# Altium schematic sheet QCLogic Rev A Sht7 MCU CTRL.SchDoc
size A4
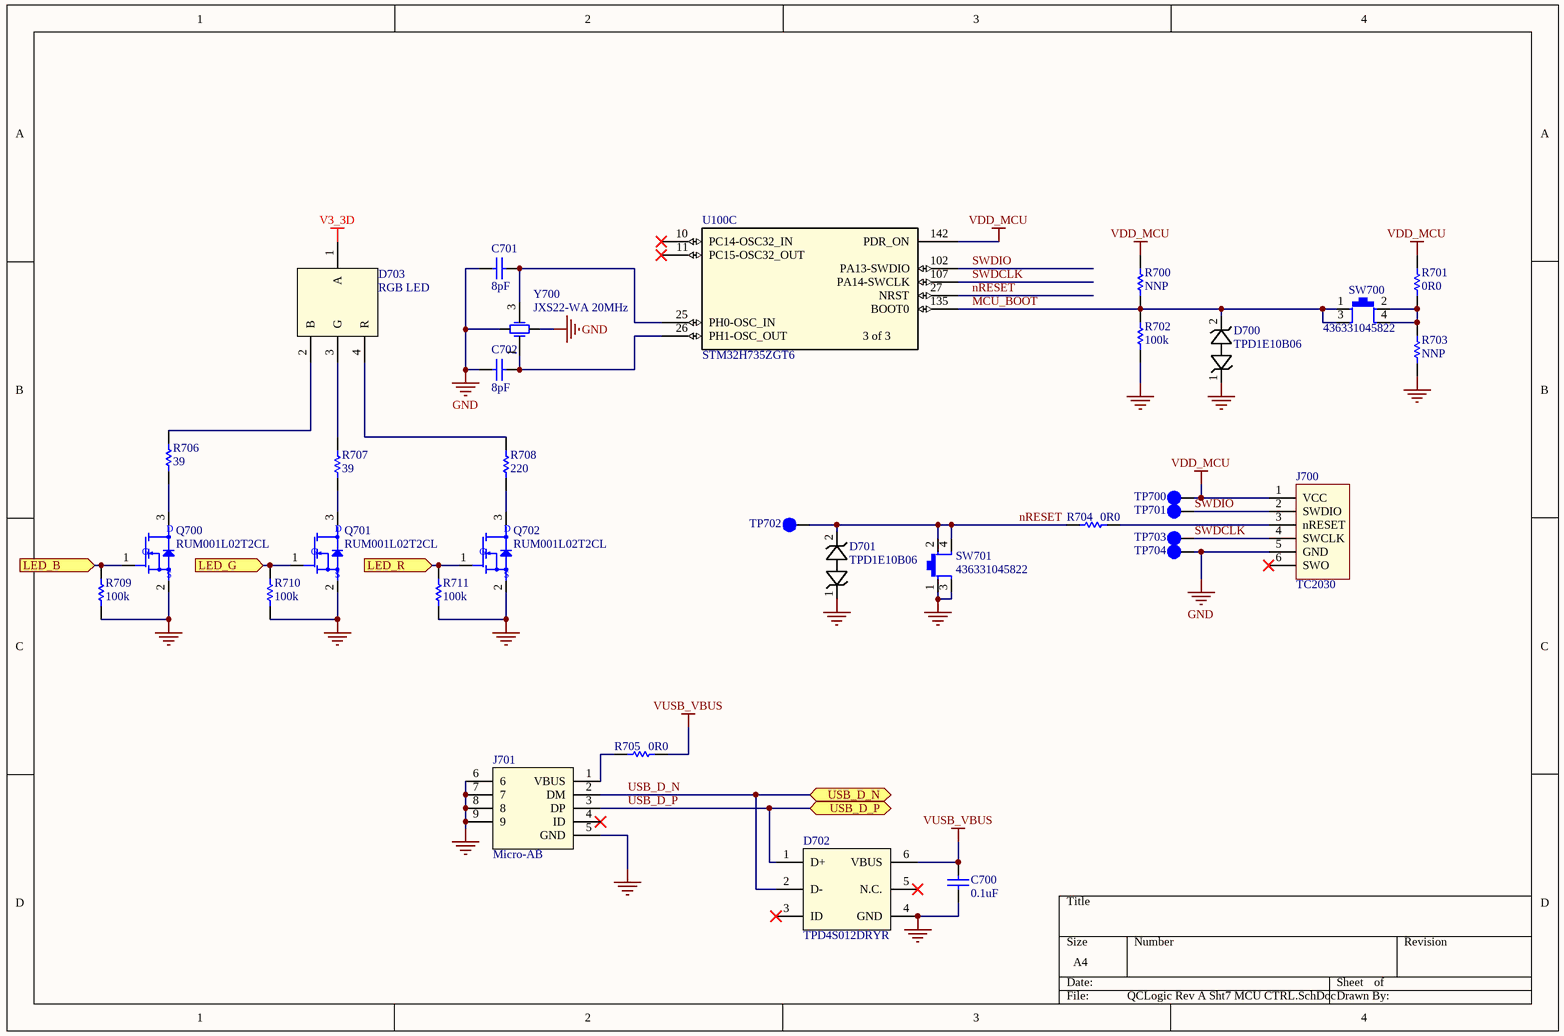
[diagram p0: QCLogic Rev A Sht7 MCU CTRL.SchDoc]

## Parts
C700  0.1uF  [SMD CAP 0402]
C701  8pF  [SMD CAP 0402]
C702  8pF  [SMD CAP 0402]
D700  TPD1E10B06  [DIODE 0402 2-X1SON]
D701  TPD1E10B06  [DIODE 0402 2-X1SON]
D702  TPD4S012DRYR  [SON-6 1.45x1]
D703  RGB LED  [PLCC-4 LED ASMB-MTB0-0A3A2]
J700  TC2030  [tag-connect-6]
J701  Micro-AB  [CONN USB MICRO_AB]
Q700  RUM001L02T2CL  [SOT-723]
Q701  RUM001L02T2CL  [SOT-723]
Q702  RUM001L02T2CL  [SOT-723]
R700  NNP  [SMD RES 0402]  (no BOM)
R701  0R0  [SMD RES 0402]
R702  100k  [SMD RES 0402]
R703  NNP  [SMD RES 0402]  (no BOM)
R704  0R0  [SMD RES 0402]
R705  0R0  [SMD RES 0402]
R706  39  [SMD RES 0402]
R707  39  [SMD RES 0402]
R708  220  [SMD RES 0402]
R709  100k  [SMD RES 0402]
R710  100k  [SMD RES 0402]
R711  100k  [SMD RES 0402]
SW700  436331045822  [BUTTON 436331045822]
SW701  436331045822  [BUTTON 436331045822]
TP700  TESTPOINT SMD  [TESTPOINT 1mm DIA]  (value not drawn)  (no BOM)
TP701  TESTPOINT SMD  [TESTPOINT 1mm DIA]  (value not drawn)  (no BOM)
TP702  TESTPOINT SMD  [TESTPOINT 1mm DIA]  (value not drawn)  (no BOM)
TP703  TESTPOINT SMD  [TESTPOINT 1mm DIA]  (value not drawn)  (no BOM)
TP704  TESTPOINT SMD  [TESTPOINT 1mm DIA]  (value not drawn)  (no BOM)
U100  STM32H735ZGT6  [LQFP-144 20x20]  (part C of 3)
Y700  JXS22-WA 20MHz  [XTAL JXS22-WA]

## Ports
LED_B (in), LED_G (in), LED_R (in), USB_D_N (bidir), USB_D_P (bidir)

## Nets
GND: C700.1 C701.2 C702.2 D700.1 D701.1 D702.4(GND) J700.5(GND) J701.5(GND) J701.6 J701.7 J701.8 J701.9 Q700.2 Q701.2 Q702.2 R702.2 R703.2 R709.2 R710.2 R711.2 SW701.1 SW701.3 TP704.1 Y700.2 Y700.4
V3_3D: D703.1(A)
VDD_MCU: J700.1(VCC) R700.1 R701.1 TP700.1 U100.142(PDR_ON)
VUSB_VBUS: C700.2 D702.6(VBUS) R705.2
LED_B: Q700.1(G) R709.1 ; port LED_B
LED_G: Q701.1(G) R710.1 ; port LED_G
LED_R: Q702.1(G) R711.1 ; port LED_R
MCU_BOOT: D700.2 R700.2 R702.1 SW700.1 SW700.3 U100.135(BOOT0)
nRESET: D701.2 R704.1 SW701.2 SW701.4 TP702.1 U100.27(NRST)
SWDCLK: J700.4(SWCLK) TP703.1 U100.107(PA14-SWCLK)
SWDIO: J700.2(SWDIO) TP701.1 U100.102(PA13-SWDIO)
USB_D_N: D702.2(D-) J701.2(DM) ; port USB_D_N
USB_D_P: D702.1(D+) J701.3(DP) ; port USB_D_P
NetC701_1: C701.1 U100.25(PH0-OSC_IN) Y700.3
NetC702_1: C702.1 U100.26(PH1-OSC_OUT) Y700.1
NetD703_2: D703.2(B) R706.2
NetD703_3: D703.3(G) R707.2
NetD703_4: D703.4(R) R708.2
NetJ700_3: J700.3(nRESET) R704.2
NetJ701_1: J701.1(VBUS) R705.1
NetQ700_3: Q700.3 R706.1
NetQ701_3: Q701.3 R707.1
NetQ702_3: Q702.3 R708.1
NetR701_2: R701.2 R703.1 SW700.2 SW700.4

Not connected (* = marked no-connect by the designer): D702 3(ID)* 5(N.C.)*; J700 6(SWO)*; J701 4(ID)*; U100 10(PC14-OSC32_IN)* 11(PC15-OSC32_OUT)*

## Notes on the sheet
- (in symbol IC MCU STM32H735ZG Arm M7, part C) 3 of 3
- (in symbol TRANS FET N-CH 20V 0.1A SOT-723 RUM001L02T2CL) D; S

## Library data of the parts
C700 = CAP MLCC SMD: CAP CER 0.1UF 25V X7R 0402; 1. Manufacturer: Yageo; 2. Manufacturer Part Number: CC0402KRX7R8BB104; 4. Package: 0402; 3. Date Modified: 20201122
C701 C702 = CAP MLCC SMD: CAP CER 8PF 50V C0G/NP0 0402; 1. Manufacturer: Samsung Electro-Mechanics; 2. Manufacturer Part Number: CL05C080CB5NNNC; 4. Package: 0402; 3. Date Modified: 20201127
D700 D701 = DIODE TVS DIODE 5.5V 14V 2X1SON: 1. Manufacturer: Texas Instruments; 2. Manufacturer Part Number: TPD1E10B06DPYR; 3. Date Modified: 20200805
D702 = DIODE TVS 4CH 5.5V 6SON: 1. Manufacturer: Texas Instruments; 2. Manufacturer Part Number: TPD4S012DRYR; 3. Date Modified: 20200910
D703 = LED RGB DIFFUSED 4PLCC SMD: 1. Manufacturer: Broadcom Limited; 2. Manufacturer Part Number: ASMB-MTB0-0A3A2; 3. Date Modified: 20201125
J700 = TC2030: TC2030 PGM PADS; 1. Manufacturer: NA; 2. Manufacturer Part Number: NA
J701 = CONN RCPT USB2.0 MICRO AB SMD RA: 1. Manufacturer: Hirose Electric Co Ltd; 2. Manufacturer Part Number: ZX62-AB-5PA(31); 3. Date Modified: 20200821
Q700-Q702 = TRANS FET N-CH 20V 0.1A SOT-723 RUM001L02T2CL: 1. Manufacturer: Rohm Semiconductor; 2. Manufacturer Part Number: RUM001L02T2CL; 3. Date Modified: 20200911
R700 R702 R709-R711 = RES SMD: RES SMD 100K OHM 1% 1/16W 0402; 1. Manufacturer: Yageo; 2. Manufacturer Part Number: RC0402FR-07100KL; 4. Package: 0402; 3. Date Modified: 20201126
R701 R703-R705 = RES SMD: RES SMD 0 OHM JUMPER 1/16W 0402; 1. Manufacturer: Yageo; 2. Manufacturer Part Number: RC0402FR-070RL; 4. Package: 0402; 3. Date Modified: 20201122
R706 R707 = RES SMD: RES SMD 39 OHM 5% 1/16W 0402; 1. Manufacturer: Yageo; 2. Manufacturer Part Number: RC0402JR-0739RL; 4. Package: 0402; 3. Date Modified: 20201125
R708 = RES SMD: RES SMD 220 OHM 5% 1/16W 0402; 1. Manufacturer: Yageo; 2. Manufacturer Part Number: RC0402JR-07220RL; 4. Package: 0402; 3. Date Modified: 20201125
SW700 SW701 = SWITCH R/A TACTILE SPST-NO 0.05A 12V: 1. Manufacturer: Würth Elektronik; 2. Manufacturer Part Number: 436331045822; 3. Date Modified: 20201127
TP700-TP704 = TESTPOINT PAD: TESTPOINT SMD PAD; 1. Manufacturer: *; 2. Manufacturer Part Number: *; 3. Date Modified: *
U100 = IC MCU STM32H735ZG Arm M7: ARM® Cortex®-M7 STM32H7 Microcontroller IC 32-Bit 550MHz 1MB (1M x 8) FLASH 144 LQFP 20x20; 1. Manufacturer: STMicroelectronics; 2. Manufacturer Part Number: STM32H735ZGT6; 3. Date Modified: 20201126
Y700 = XTAL JXS22-WA 20MHz 10PF SMD: 1. Manufacturer: Jauch Quartz; 2. Manufacturer Part Number: Q 20,0-JXS22-10-10/15-T1-FU-WA-LF; 3. Date Modified: 20200811